# Altium schematic sheet P06_Audio .SchDoc
size 246 x 182 mm
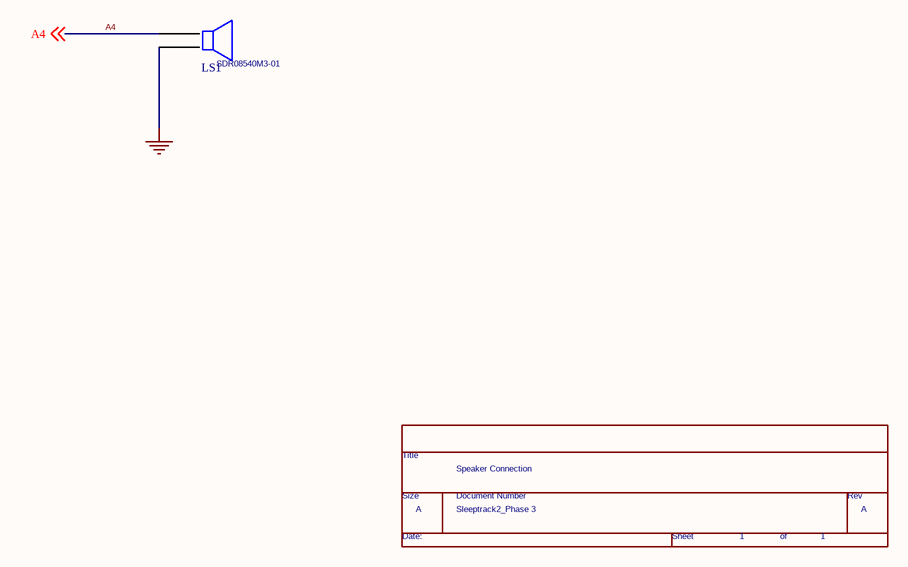
[diagram p0: P06_Audio .SchDoc]

## Parts
*  Doc: Sleeptrack2_Phase 3  RevCode: A  Title: Speaker Connection  Page Number: 1  (hidden comment: TitleBlock0)  (graphical)
LS1  SDR08540M3-01  [SDR08540M3-01]

## Nets
GND: LS1.2
A4: LS1.1 ; off-sheet A4

## Notes on the sheet
- (in symbol TitleBlock0) Title; Size; Document Number; Rev; Date:; Sheet; of

## Library data of the parts
LS1 = SDR08540M3-01: Speakers & Transducers 88dB 85mA 3volts 2670Hz
* = TitleBlock0: Page Create Date: March  8, 1995; Page Size: A; Page Count: 1